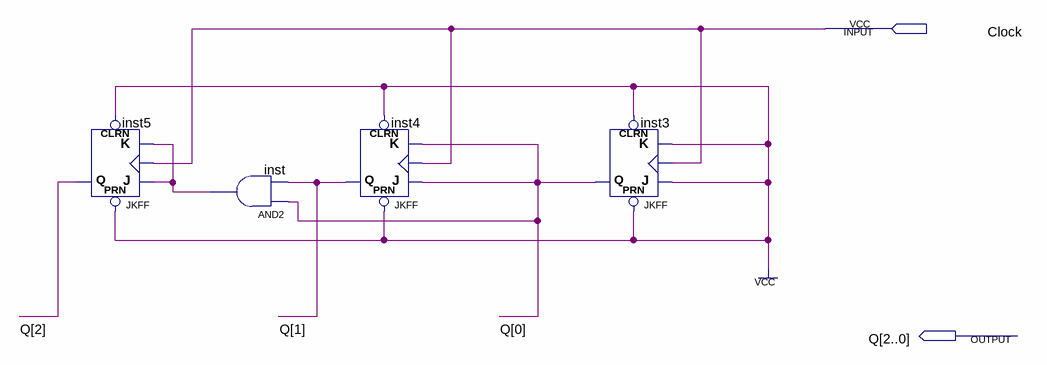
[diagram p0: schematic sheet]
// Quartus schematic Counter.bdf as structural Verilog: 4 symbols, 2 pins
module Counter (
  input  Clock,
  output [2:0] Q
);

  wire inst_out;

  JKFF inst5 (.PRN(1'b1), .CLRN(1'b1), .K(inst_out), .J(inst_out), .CLK(Clock), .Q(Q[2]));
  and inst (inst_out, Q[0], Q[1]);
  JKFF inst4 (.PRN(1'b1), .CLRN(1'b1), .K(Q[0]), .J(Q[0]), .CLK(Clock), .Q(Q[1]));
  JKFF inst3 (.PRN(1'b1), .CLRN(1'b1), .K(1'b1), .J(1'b1), .CLK(Clock), .Q(Q[0]));
endmodule
